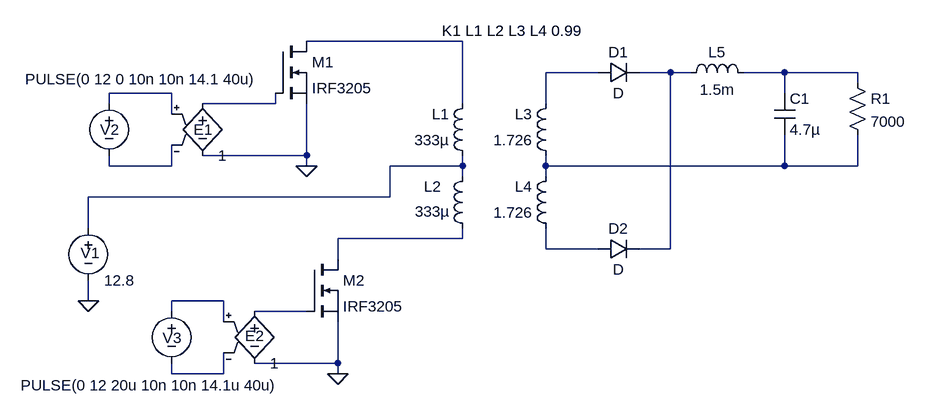
[diagram p0: schematic Pushpull_ckt.asc]
Pushpull_ckt.asc, the LTspice schematic file:
Version 4.1
SHEET 1 1204 680
WIRE 512 -96 272 -96
WIRE 720 -48 640 -48
WIRE 832 -48 784 -48
WIRE 864 -48 832 -48
WIRE 1008 -48 944 -48
WIRE 1120 -48 1008 -48
WIRE 1120 -32 1120 -48
WIRE 64 -16 -32 -16
WIRE 1008 -16 1008 -48
WIRE -32 0 -32 -16
WIRE 224 0 224 -16
WIRE 224 0 112 0
WIRE 512 0 512 -96
WIRE 640 0 640 -48
WIRE 64 16 64 -16
WIRE 272 80 272 0
WIRE 272 80 112 80
WIRE -32 96 -32 80
WIRE 64 96 64 64
WIRE 64 96 -32 96
WIRE 272 96 272 80
WIRE 512 96 512 80
WIRE 512 96 400 96
WIRE 640 96 640 80
WIRE 1008 96 1008 48
WIRE 1008 96 640 96
WIRE 1120 96 1120 48
WIRE 1120 96 1008 96
WIRE 512 112 512 96
WIRE 640 112 640 96
WIRE 400 144 400 96
WIRE 400 144 -64 144
WIRE -64 192 -64 144
WIRE 512 208 512 192
WIRE 512 208 320 208
WIRE 640 224 640 192
WIRE 720 224 640 224
WIRE 832 224 832 -48
WIRE 832 224 784 224
WIRE 320 240 320 208
WIRE -64 304 -64 272
WIRE 144 304 64 304
WIRE 64 320 64 304
WIRE 272 320 192 320
WIRE 144 336 144 304
WIRE 320 400 320 336
WIRE 320 400 192 400
WIRE 64 416 64 400
WIRE 144 416 144 384
WIRE 144 416 64 416
WIRE 320 416 320 400
FLAG -64 304 0
FLAG 320 416 0
FLAG 272 96 0
SYMBOL voltage -64 176 R0
WINDOW 0 -12 54 Left 2
SYMATTR InstName V1
SYMATTR Value 12.8
SYMBOL nmos 224 -96 R0
SYMATTR InstName M1
SYMATTR Value IRF3205
SYMBOL nmos 272 240 R0
SYMATTR InstName M2
SYMATTR Value IRF3205
SYMBOL e 112 -16 R0
WINDOW 0 -14 56 Left 2
SYMATTR InstName E1
SYMATTR Value 1
SYMBOL e 192 304 R0
WINDOW 0 -15 54 Left 2
SYMATTR InstName E2
SYMATTR Value 1
SYMBOL ind 528 96 R180
WINDOW 0 36 80 Left 2
WINDOW 3 36 40 Left 2
SYMATTR InstName L1
SYMATTR Value 333µ
SYMATTR Type ind
SYMATTR SpiceLine Rser=1m
SYMBOL ind 528 208 R180
WINDOW 0 48 80 Left 2
WINDOW 3 35 42 Left 2
SYMATTR InstName L2
SYMATTR Value 333µ
SYMATTR Type ind
SYMATTR SpiceLine Rser=1m
SYMBOL ind 656 96 R180
WINDOW 0 36 80 Left 2
WINDOW 3 36 40 Left 2
SYMATTR InstName L3
SYMATTR Value 1.726
SYMATTR Type ind
SYMATTR SpiceLine Rser=1m
SYMBOL voltage -32 -16 R0
WINDOW 0 -14 56 Left 2
WINDOW 3 -129 -22 Left 2
WINDOW 123 0 0 Left 0
WINDOW 39 0 0 Left 0
SYMATTR InstName V2
SYMATTR Value PULSE(0 12 0 10n 10n 14.1 40u)
SYMBOL voltage 64 304 R0
WINDOW 0 -14 57 Left 2
WINDOW 3 -232 130 Left 2
WINDOW 123 0 0 Left 0
WINDOW 39 0 0 Left 0
SYMATTR InstName V3
SYMATTR Value PULSE(0 12 20u 10n 10n 14.1u 40u)
SYMBOL ind 656 208 R180
WINDOW 0 36 80 Left 2
WINDOW 3 36 40 Left 2
SYMATTR InstName L4
SYMATTR Value 1.726
SYMATTR Type ind
SYMATTR SpiceLine Rser=1m
SYMBOL diode 720 -32 R270
WINDOW 0 32 32 VTop 2
WINDOW 3 0 32 VBottom 2
SYMATTR InstName D1
SYMBOL diode 720 240 R270
WINDOW 0 32 32 VTop 2
WINDOW 3 0 32 VBottom 2
SYMATTR InstName D2
SYMBOL ind 848 -32 R270
WINDOW 0 32 56 VTop 2
WINDOW 3 5 56 VBottom 2
SYMATTR InstName L5
SYMATTR Value 1.5m
SYMATTR SpiceLine Rser=1m
SYMBOL cap 992 -16 R0
SYMATTR InstName C1
SYMATTR Value 4.7µ
SYMATTR SpiceLine V=450V
SYMBOL res 1104 -48 R0
SYMATTR InstName R1
SYMATTR Value 7000
TEXT 480 -112 Left 2 !K1 L1 L2 L3 L4 0.99

The netlist it stands for:
* Pushpull_ckt.asc
V1 N008 0 12.8
M1 N001 N006 0 0 IRF3205
M2 N010 N013 0 0 IRF3205
E1 N006 0 N005 N007 1
E2 N013 0 N012 N014 1
L1 N008 N001 333µ Rser=1m
L2 N010 N008 333µ Rser=1m
L3 N009 N002 1.726 Rser=1m
V2 N005 N007 PULSE(0 12 0 10n 10n 14.1 40u)
V3 N012 N014 PULSE(0 12 20u 10n 10n 14.1u 40u)
L4 N011 N009 1.726 Rser=1m
D1 N002 N003 D
D2 N011 N003 D
L5 N003 N004 1.5m Rser=1m
C1 N004 N009 4.7µ V=450V
R1 N004 N009 7000
.model D D
.lib standard.dio
.model NMOS NMOS
.model PMOS PMOS
.lib standard.mos
K1 L1 L2 L3 L4 0.99
.backanno
.end